# Altium schematic sheet joint_board.SchDoc
size A; Engineer: Ben Titus; DocumentNumber: 1; Revision: 1.0; SheetNumber: 1
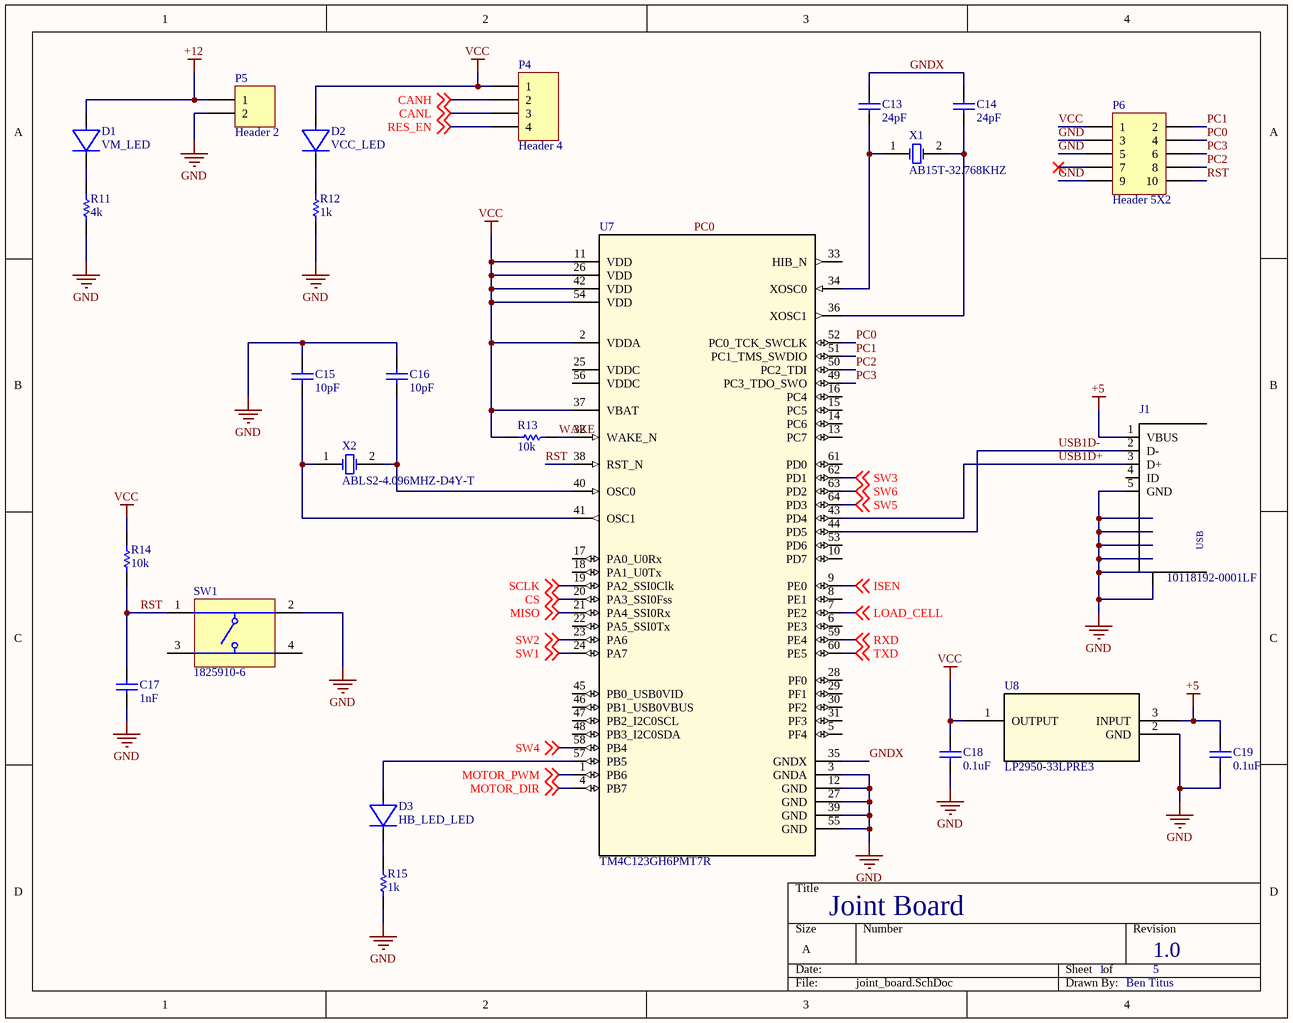
[diagram p0: joint_board.SchDoc]

## Parts
C13  24pF  [CAPC0805(2012)145_L]
C14  24pF  [CAPC0805(2012)145_L]
C15  10pF  [CAPC0805(2012)145_L]
C16  10pF  [CAPC0805(2012)145_L]
C17  1nF  [CAPC0805(2012)145_L]
C18  0.1uF  [CAPC0805(2012)145_L]
C19  0.1uF  [CAPC0805(2012)145_L]
D1  VM_LED  [0805 Diode]
D2  VCC_LED  [0805 Diode]
D3  HB_LED_LED  [0805 Diode]
J1  10118192-0001LF  [10118192-0001LF_10118192-0001LF(Primary)]
P4  Header 4  [HDR1X4]
P5  Header 2  [HDR1X2]
P6  Header 5X2  [HDR2X5]
R11  4k  [RESC0805(2012)_L]
R12  1k  [RESC0805(2012)_L]
R13  10k  [RESC0805(2012)_L]
R14  10k  [RESC0805(2012)_L]
R15  1k  [RESC0805(2012)_L]
SW1  1825910-6  [TECO-1825910-6_V]
U7  TM4C123GH6PMT7R  [PM0064A_N]
U8  LP2950-33LPRE3  [LP3]
X1  AB15T-32.768KHZ  [ABRA-AB15T-2_V]
X2  ABLS2-4.096MHZ-D4Y-T  [ABRA-ABLS2-2_V]

## Nets
+5: C19.2 J1.1(VBUS) U8.3(INPUT)
+12: D1.1 P5.1
GND: C15.2 C16.2 C17.1 C18.1 C19.1 J1.5(GND) J1.M1(S) J1.M2(S) J1.S1(S) J1.S2(S) J1.S3(S) J1.S4(S) P5.2 P6.3 P6.5 P6.9 R11.1 R12.1 R15.1 SW1.2 U7.3(GNDA) U7.12(GND) U7.27(GND) U7.39(GND) U7.55(GND) U8.2(GND)
VCC: C18.2 D2.1 P4.1 P6.1 R13.1 R14.2 U7.2(VDDA) U7.11(VDD) U7.26(VDD) U7.37(VBAT) U7.42(VDD) U7.54(VDD) U8.1(OUTPUT)
CANH: P4.2 ; off-sheet CANH
CANL: P4.3 ; off-sheet CANL
CS: U7.20(PA3_SSI0Fss) ; off-sheet CS
GNDX: C13.2 C14.2 U7.35(GNDX)
ISEN: U7.9(PE0) ; off-sheet ISEN
LOAD_CELL: U7.7(PE2) ; off-sheet LOAD_CELL
MISO: U7.21(PA4_SSI0Rx) ; off-sheet MISO
MOTOR_DIR: U7.4(PB7) ; off-sheet MOTOR_DIR
MOTOR_PWM: U7.1(PB6) ; off-sheet MOTOR_PWM
PC0: P6.4 U7.52(PC0_TCK_SWCLK)
PC1: P6.2 U7.51(PC1_TMS_SWDIO)
PC2: P6.8 U7.50(PC2_TDI)
PC3: P6.6 U7.49(PC3_TDO_SWO)
RES_EN: P4.4 ; off-sheet RES_EN
RST: C17.2 P6.10 R14.1 SW1.1 U7.38(RST_N)
RXD: U7.59(PE4) ; off-sheet RXD
SCLK: U7.19(PA2_SSI0Clk) ; off-sheet SCLK
SW1: U7.24(PA7) ; off-sheet SW1
SW2: U7.23(PA6) ; off-sheet SW2
SW3: U7.62(PD1) ; off-sheet SW3
SW4: U7.58(PB4) ; off-sheet SW4
SW5: U7.64(PD3) ; off-sheet SW5
SW6: U7.63(PD2) ; off-sheet SW6
TXD: U7.60(PE5) ; off-sheet TXD
USB1D+: J1.3(D+) U7.43(PD4)
USB1D-: J1.2(D-) U7.44(PD5)
WAKE: R13.2 U7.32(WAKE_N)
NetC13_1: C13.1 U7.34(XOSC0) X1.1(X1)
NetC14_1: C14.1 U7.36(XOSC1) X1.2(X2)
NetC15_1: C15.1 U7.41(OSC1) X2.1(X1)
NetC16_1: C16.1 U7.40(OSC0) X2.2(X2)
NetD1_2: D1.2 R11.2
NetD2_2: D2.2 R12.2
NetD3_1: D3.1 U7.57(PB5)
NetD3_2: D3.2 R15.2

Not connected (* = marked no-connect by the designer): J1 4(ID); P6 7*; SW1 3 4; U7 5(PF4) 6(PE3) 8(PE1) 10(PD7) 13(PC7) 14(PC6) 15(PC5) 16(PC4) 17(PA0_U0Rx) 18(PA1_U0Tx) 22(PA5_SSI0Tx) 25(VDDC) 28(PF0) 29(PF1) 30(PF2) 31(PF3) 33(HIB_N) 45(PB0_USB0VID) 46(PB1_USB0VBUS) 47(PB2_I2C0SCL) 48(PB3_I2C0SDA) 53(PD6) 56(VDDC) 61(PD0)

## Notes on the sheet
- Joint Board
- 1
- 1.0
- 5
- Ben Titus
- Labels drawn without touching a wire or pin: PC0
- (in symbol 10118192-0001LF) USB

## Library data of the parts
C13-C19 = CMP-1590-00003-1: 0805 (2012 Metric) Chip Capacitor; Case-EIA: 0805; Case-Metric: 2012; PackageReference: CAPC0805(2012)145
D1-D3 = SMD_LED
J1 = 10118192-0001LF: CONN USB MICRO B RECPT SMT R/A; MF: Amphenol; Package: None; Price: 0.22 USD; MP: 10118192-0001LF; Availability: Good; Value: *
P4 = Header 4: Header, 4-Pin; LatestRevisionDate: 17-Jul-2002; LatestRevisionNote: Re-released for DXP Platform.; Publisher: Altium Limited
P5 = Header 2: Header, 2-Pin; LatestRevisionDate: 17-Jul-2002; LatestRevisionNote: Re-released for DXP Platform.; Publisher: Altium Limited
P6 = Header 5X2: Header, 5-Pin, Dual row; LatestRevisionDate: 17-Jul-2002; LatestRevisionNote: Re-released for DXP Platform.; Publisher: Altium Limited
R11-R15 = CMP-1591-00002-1: 0805 (2012 Metric) Chip Resistor; Case-EIA: 0805; Case-Metric: 2012; PackageReference: RESC0805(2012)
SW1 = CMP-1684-00021-1: Tact Switch, SPST-NO, 0.05 A, -35 to 85 degC, 4-Pin THD, RoHS, Bulk; Manufacturer: TE Connectivity; Maximum Contact Resistance: 100mOhm; Mechanical Life: 100000Cycles; Bushing Type: Unthreaded; Switch Configuration: OFF(ON); Maximum DC Voltage Rating: 24V; Contact Rating @ Voltage: 0.05A@24VDC; Actuator Color: Black; Body Orientation: Straight; Function: MomentaryContact; Illumination: N/R; Actuator Style: RoundButton; Actuator Material: PolybutyleneTerephthalate; Dielectric Strength: 500VAC; Pole Throw Configuration: SPST; Actuator Length: 1.4mm; Product Weight: N/A; Contact Material: CopperAlloy; Housing Material: N/A; Terminal Type: PCPins; Minimum Insulation Resistance: 100MOhm; Package Description: 4-Pin Through Hole Device, Body 5.99 x 5.99 mm, Pitch 6.5 mm; Part No: 1825910-6; Package Reference: THD; Base Material: N/A; Manufacturer URL: http://www.te.com; Contact Plating: Silver; RoHS: Yes; Datasheet Version: Rev. C9; Electrical Life: 100000Cycles; Maximum AC Voltage Rating: N/A; Thread Size: N/R; Operating Temperature: -35to85C; Mounting: ThroughHole; Dimension: 5.99x5mm; Datasheet URL: http://www.te.com/commerce/DocumentDelivery/DDEController?Action=showdoc&DocId=Customer+Drawing%7F1825910%7FC9%7Fpdf%7FEnglish%7FENG_CD_1825910_C9.pdf%7F1825910-6; Family: 1825910; Seal Location: N/A; Seal Description: N/A; Packaging: N/A
U7 = TM4C123GH6PMT7R: Imported; PartNumber: TM4C123GH6PMTR; Manufacturer: Texas Instruments; CompType: IC; PIN_COUNT: 64; Application_BuildNumber: *; Alternate_PartNumber: TM4C123GH6PMT; PackageReference: PM0064A; MountType: SMT; RoHS: Y; RefDes: RefDes; TYPE: TYPE; Value: Value
U8 = LP2950-33LPRE3: Imported; Manufacturer: Texas Instruments; Built_By: EMA_UL_Team; C: Copyright (C) 2015 Accelerated Designs. All rights reserved; Vendor: Texas Instruments; Manufacturer_Part_Number: LP2950-33LPRE3; Value: Value; Type: Type; RefDes: RefDes
X1 = CMP-1326-00001-1: Low Frequency Cylindrical Watch Crystal, 32.768 kHz, -20 to 70 degC, 2-Pin 5 x 1.4 x 1.5 mm THD, RoHS, Bulk; Manufacturer: Abracon; ESR: 40 KOhm Max.; Shunt Capacitance C0: 1 pF Typ.; Load Capacitance CL: 12.5 pF; ComponentLink1URL: http://www.abracon.com/; Temperature Range: -20 to 70 degC; ComponentLink1Description: Manufacturer URL; PackageDescription: 2-Pin THD, Body 5 x 1.4 mm, Pin Spacing 0.45 mm; Frequency: 32.768 kHz; ComponentLink2URL: http://www.abracon.com/Resonators/AB15T.pdf; ComponentLink2Description: Datasheet; ComponentLink3Description: Package Specification; DatasheetVersion: Jun-10; Packing: Bulk; Mounting Technology: Through Hole; RoHS: TRUE; PartNumber: AB15T-32.768KHZ; ComponentLink3URL: http://www.abracon.com/Resonators/AB15T.pdf
X2 = CMP-0277-00002-1: Low Profile Surface Mount Microprocessor Crystal, 4.096 MHz +/-30 ppm, 180 Ohm, -40 to 85 degC, 2-Pin 11.4 x 4.7 x 3.3 mm SMD, RoHS, Tape and Reel; Manufacturer: Abracon; Operation Mode: Fundamental or 3rd Overtone; Shunt Capacitance: 7 pF Max.; ESR: 180 Ohm; Load Capacitance: 18 pF; Mounting Technology: Surface Mount; PackageDescription: 2-Pin SMD, Body 11.4 x 4.7 mm, Height 3.3 mm; ComponentLink1URL: http://www.abracon.com/; Freq. Stability: +/- 30 ppm; ComponentLink2Description: Datasheet; PartNumber: ABLS2-4.096MHZ-D4Y-T; Operating Temp. Range: -40 to 85 degC; Packing: Tape and Reel; RoHS: TRUE; PackageReference: ABLS2-2; DatasheetVersion: Rev. 03.31.11; Freq. Tolerance: +/- 30 ppm; Frequency: 4.096 MHz; ComponentLink2URL: http://www.abracon.com/Resonators/ABLS2.pdf; ComponentLink1Description: Manufacturer URL